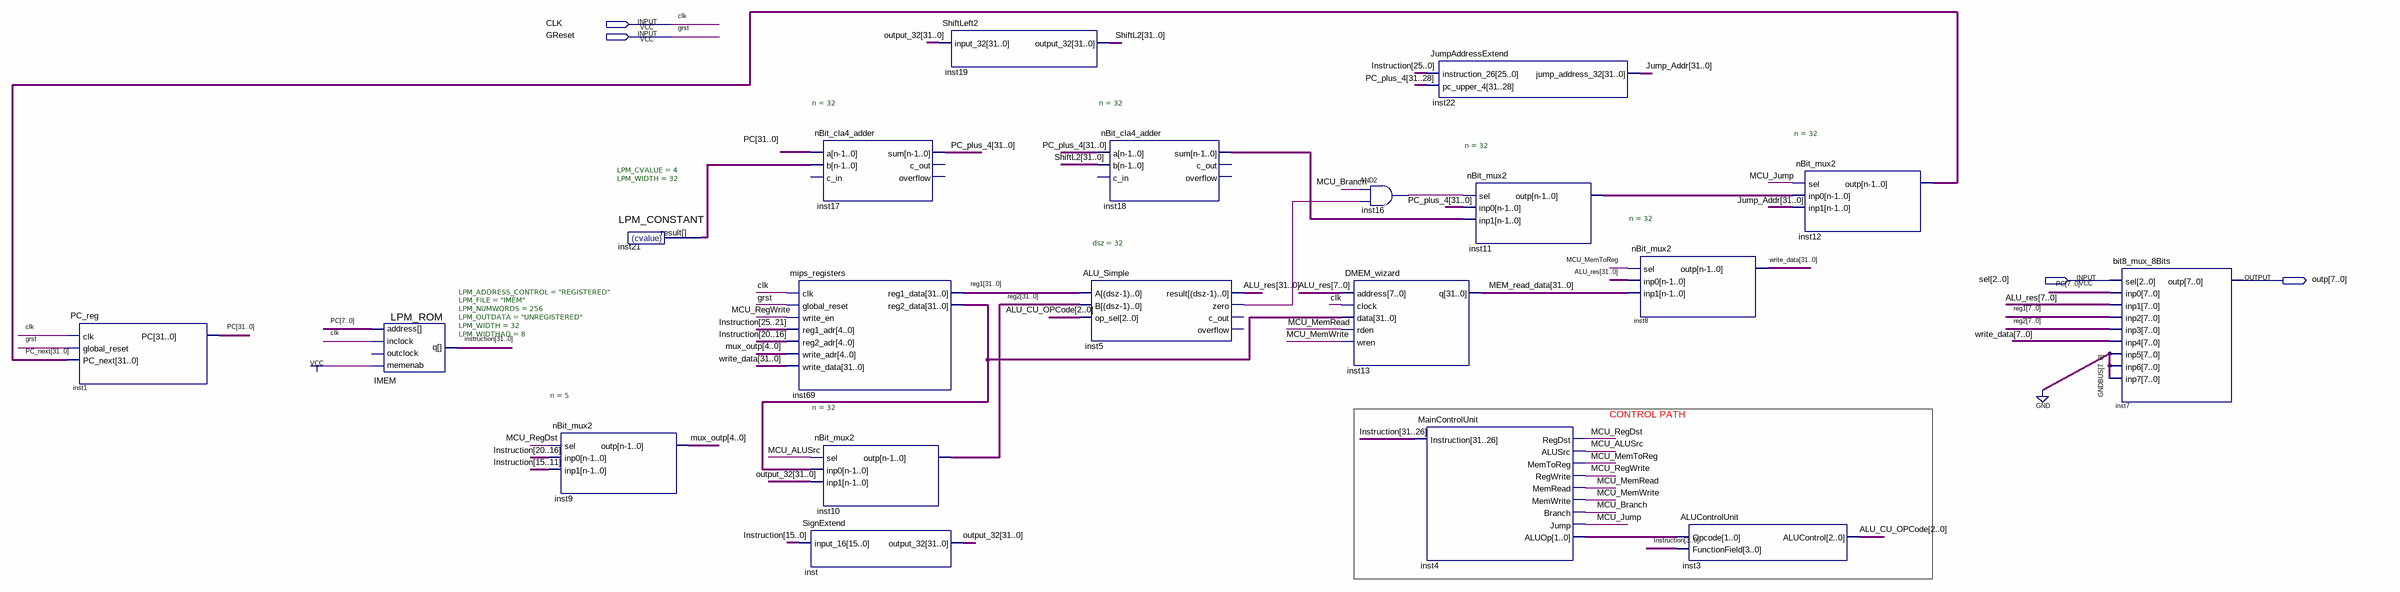
[diagram p0: schematic sheet]
// Quartus schematic top_level.bdf as structural Verilog: 20 symbols, 4 pins
module top_level (
  input  CLK,
  input  GReset,
  input  [2:0] sel,
  output [7:0] outp
);

  wire inst5_zero, inst16_out, MCU_ALUSrc, MCU_Branch, MCU_Jump, MCU_MemRead, MCU_MemToReg, MCU_MemWrite,
       MCU_RegDst, MCU_RegWrite;
  wire [1:0] inst4_aluop;
  wire [2:0] ALU_CU_OPCode;
  wire [4:0] mux_outp;
  wire [31:0] ALU_res, inst11_outp, inst18_sum, inst21_result, inst69_reg2_data, Instruction, Jump_Addr,
       MEM_read_data, output_32, PC, PC_next, PC_plus_4, reg1, reg2, ShiftL2, write_data;

  PC_reg inst1 (.clk(CLK), .global_reset(GReset), .PC_next(PC_next), .PC(PC));
  LPM_ROM #(.LPM_ADDRESS_CONTROL("REGISTERED"), .LPM_FILE("IMEM"), .LPM_NUMWORDS(256), .LPM_OUTDATA("UNREGISTERED"), .LPM_WIDTH(32), .LPM_WIDTHAD(8)) IMEM (
    .address(PC[7:0]), .inclock(CLK), .memenab(1'b1), .q(Instruction));  // open: outclock
  nBit_mux2 #(.n(5)) inst9 (.sel(MCU_RegDst), .inp0(Instruction[20:16]), .inp1(Instruction[15:11]), .outp(mux_outp));
  LPM_CONSTANT #(.LPM_CVALUE(4), .LPM_WIDTH(32)) inst21 (.result(inst21_result));
  mips_registers inst69 (
    .clk(CLK), .global_reset(GReset), .write_en(MCU_RegWrite), .reg1_adr(Instruction[25:21]),
    .reg2_adr(Instruction[20:16]), .write_adr(mux_outp), .write_data(write_data), .reg1_data(reg1),
    .reg2_data(inst69_reg2_data));
  SignExtend inst (.input_16(Instruction[15:0]), .output_32(output_32));
  nBit_cla4_adder #(.n(32)) inst17 (.a(PC), .b(inst21_result), .sum(PC_plus_4));  // open: c_in, c_out, overflow
  nBit_mux2 #(.n(32)) inst10 (.sel(MCU_ALUSrc), .inp0(inst69_reg2_data), .inp1(output_32), .outp(reg2));
  ShiftLeft2 inst19 (.input_32(output_32), .output_32(ShiftL2));
  nBit_cla4_adder #(.n(32)) inst18 (.a(PC_plus_4), .b(ShiftL2), .sum(inst18_sum));  // open: c_in, c_out, overflow
  ALU_Simple #(.dsz(32)) inst5 (
    .A(reg1), .B(reg2), .op_sel(ALU_CU_OPCode), .result(ALU_res), .zero(inst5_zero));  // open: c_out, overflow
  DMEM_wizard inst13 (
    .address(ALU_res[7:0]), .clock(CLK), .data(inst69_reg2_data), .rden(MCU_MemRead), .wren(MCU_MemWrite),
    .q(MEM_read_data));
  and inst16 (inst16_out, MCU_Branch, inst5_zero);
  JumpAddressExtend inst22 (
    .instruction_26(Instruction[25:0]), .pc_upper_4(PC_plus_4[31:28]), .jump_address_32(Jump_Addr));
  MainControlUnit inst4 (
    .Instruction(Instruction[31:26]), .RegDst(MCU_RegDst), .ALUSrc(MCU_ALUSrc), .MemToReg(MCU_MemToReg),
    .RegWrite(MCU_RegWrite), .MemRead(MCU_MemRead), .MemWrite(MCU_MemWrite), .Branch(MCU_Branch),
    .Jump(MCU_Jump), .ALUOp(inst4_aluop));
  nBit_mux2 #(.n(32)) inst11 (.sel(inst16_out), .inp0(PC_plus_4), .inp1(inst18_sum), .outp(inst11_outp));
  nBit_mux2 #(.n(32)) inst8 (.sel(MCU_MemToReg), .inp0(ALU_res), .inp1(MEM_read_data), .outp(write_data));
  ALUControlUnit inst3 (.Opcode(inst4_aluop), .FunctionField(Instruction[3:0]), .ALUControl(ALU_CU_OPCode));
  nBit_mux2 #(.n(32)) inst12 (.sel(MCU_Jump), .inp0(inst11_outp), .inp1(Jump_Addr), .outp(PC_next));
  bit8_mux_8Bits inst7 (
    .sel(sel), .inp0(PC[7:0]), .inp1(ALU_res[7:0]), .inp2(reg1[7:0]), .inp3(reg2[7:0]),
    .inp4(write_data[7:0]), .inp5({8{1'b0}}), .inp6({8{1'b0}}), .inp7({8{1'b0}}), .outp(outp));

  // Other names for the same wires on the sheet: grst = GReset

  // Notes on the sheet:
  //   CONTROL PATH
endmodule
